# EAGLE design kludge (EAGLE 6.6.0)
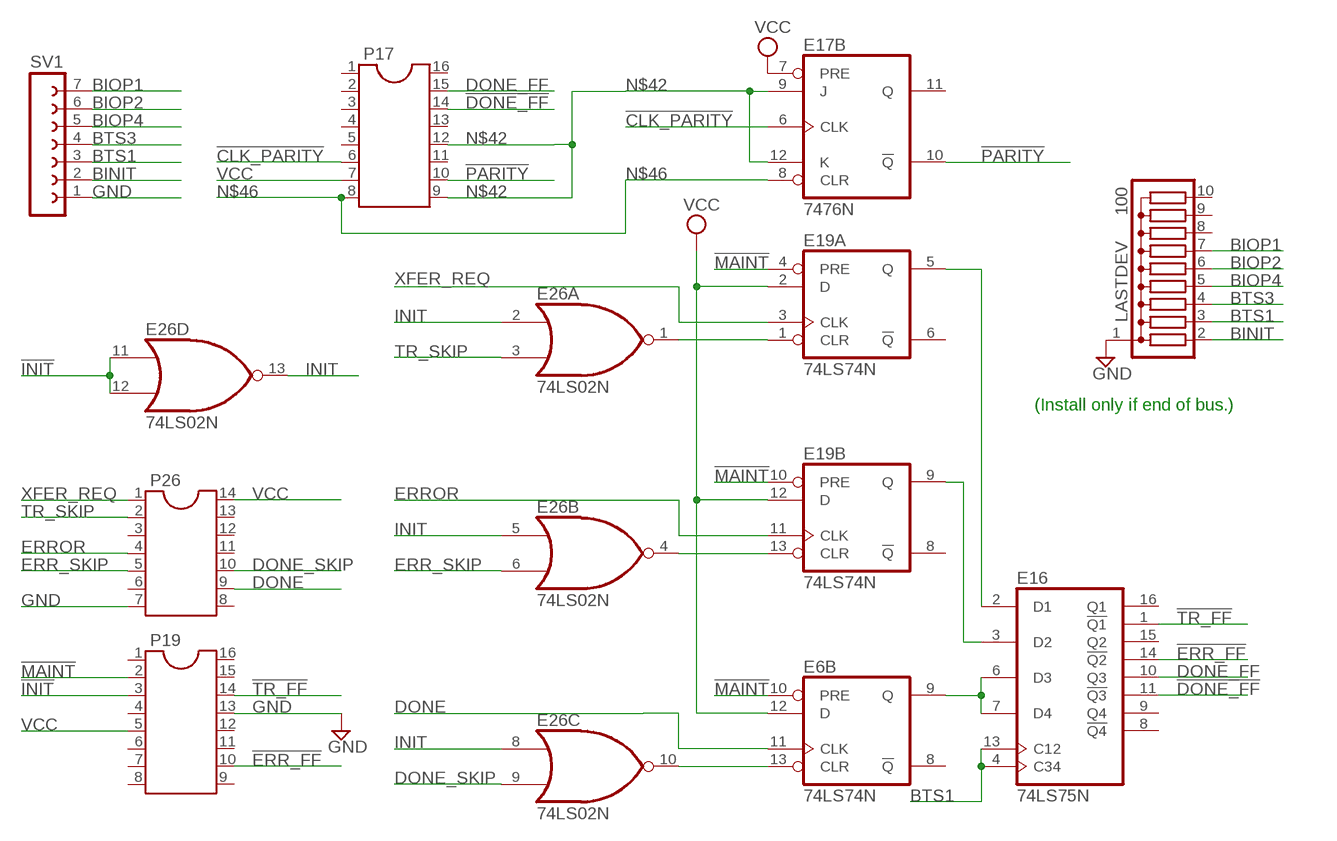
[diagram p0: schematic, sheet 1]

## Parts
E6  74LS74N  [DIL14]
E16  74LS75N  [DIL16]
E17  7476N  [DIL16]
E19  74LS74N  [DIL14]
E26  74LS02N  [DIL14]
LASTDEV  100  G09R  [SIL10]
P17  DIL16  [DIL16]
P19  DIL16  [DIL16]
P26  DIL14  [DIL14]
SV1  FE07-1  [FE07]

## Nets
!CLK_PARITY: E17.6(B:CLK) P17.6
!DONE_FF: E16.11(!Q3) P17.14
!ERR_FF: E16.14(!Q2) P19.10
!INIT: E26.11(D:I0) E26.12(D:I1) P19.3
!MAINT: E6.10(B:PRE) E19.4(A:PRE) E19.10(B:PRE) P19.2
!PARITY: E17.10(B:!Q) P17.10
!TR_FF: E16.1(!Q1) P19.14
BINIT: LASTDEV.2 SV1.2
BIOP1: LASTDEV.7 SV1.7
BIOP2: LASTDEV.6 SV1.6
BIOP4: LASTDEV.5 SV1.5
BTS1: E16.4(C34) E16.13(C12) LASTDEV.3 SV1.3
BTS3: LASTDEV.4 SV1.4
DONE: E6.11(B:CLK) P26.9
DONE_FF: E16.10(Q3) P17.15
DONE_SKIP: E26.9(C:I1) P26.10
ERR_SKIP: E26.6(B:I1) P26.5
ERROR: E19.11(B:CLK) P26.4
GND: LASTDEV.1 P19.13 P26.7 SV1.1
INIT: E26.2(A:I0) E26.5(B:I0) E26.8(C:I0) E26.13(D:O)
N$42: E17.9(B:J) E17.12(B:K) P17.9 P17.12
N$46: E17.8(B:CLR) P17.8
N$100: E16.2(D1) E19.5(A:Q)
N$103: E16.3(D2) E19.9(B:Q)
N$107: E6.9(B:Q) E16.6(D3) E16.7(D4)
N$108: E19.1(A:CLR) E26.1(A:O)
N$110: E19.13(B:CLR) E26.4(B:O)
N$111: E6.13(B:CLR) E26.10(C:O)
TR_SKIP: E26.3(A:I1) P26.2
VCC [supply]: E6.12(B:D) E17.7(B:PRE) E19.2(A:D) E19.12(B:D) P17.7 P19.5 P26.14
XFER_REQ: E19.3(A:CLK) P26.1
Unconnected: E6.1(A:CLR) E6.2(A:D) E6.3(A:CLK) E6.4(A:PRE) E6.5(A:Q) E6.6(A:!Q) E6.8(B:!Q) E16.8(!Q4) E16.9(Q4) E16.15(Q2) E16.16(Q1) E17.1(A:CLK) E17.2(A:PRE) E17.3(A:CLR) E17.4(A:J) E17.11(B:Q) E17.14(A:!Q) E17.15(A:Q) E17.16(A:K) E19.6(A:!Q) E19.8(B:!Q) LASTDEV.8 LASTDEV.9 LASTDEV.10 P17.1 P17.2 P17.3 P17.4 P17.5 P17.11 P17.13 P17.16 P19.1 P19.4 P19.6 P19.7 P19.8 P19.9 P19.11 P19.12 P19.15 P19.16 P26.3 P26.6 P26.8 P26.11 P26.12 P26.13

## Notes on the sheet
- (Install only if end of bus.)

## Power pins joined to a net without a drawn wire
GND: E6.7(P:GND) E16.12(GND) E17.13(P:GND) E19.7(P:GND) E26.7(P:GND)
VCC: E6.14(P:VCC) E16.5(VCC) E17.5(P:VCC) E19.14(P:VCC) E26.14(P:VCC)

## Library data of the parts
E6 E19 = 74xx-us:74*74: Dual D type positive edge triggered FLIP FLOP, preset and clear
E16 = 74xx-us:74*75: 4-bit bistable LATCH
E17 = 74xx-us:74*76: Dual J-K FLIP FLOP, preset and clear
E26 = 74xx-us:74*02: Quad 2-input NOR gate
LASTDEV = resistor-sil:G09R: SIL RESISTOR; OC_FARNELL: unknown; OC_NEWARK: unknown
P17 P19 = ic-package:DIL16: Dual In Line / Socket
P26 = ic-package:DIL14: Dual In Line / Socket
SV1 = con-lsta:FE07-1: FEMALE HEADER; OC_FARNELL: unknown; OC_NEWARK: unknown

## Net classes
1 supply: width 0.508 mm

## Board
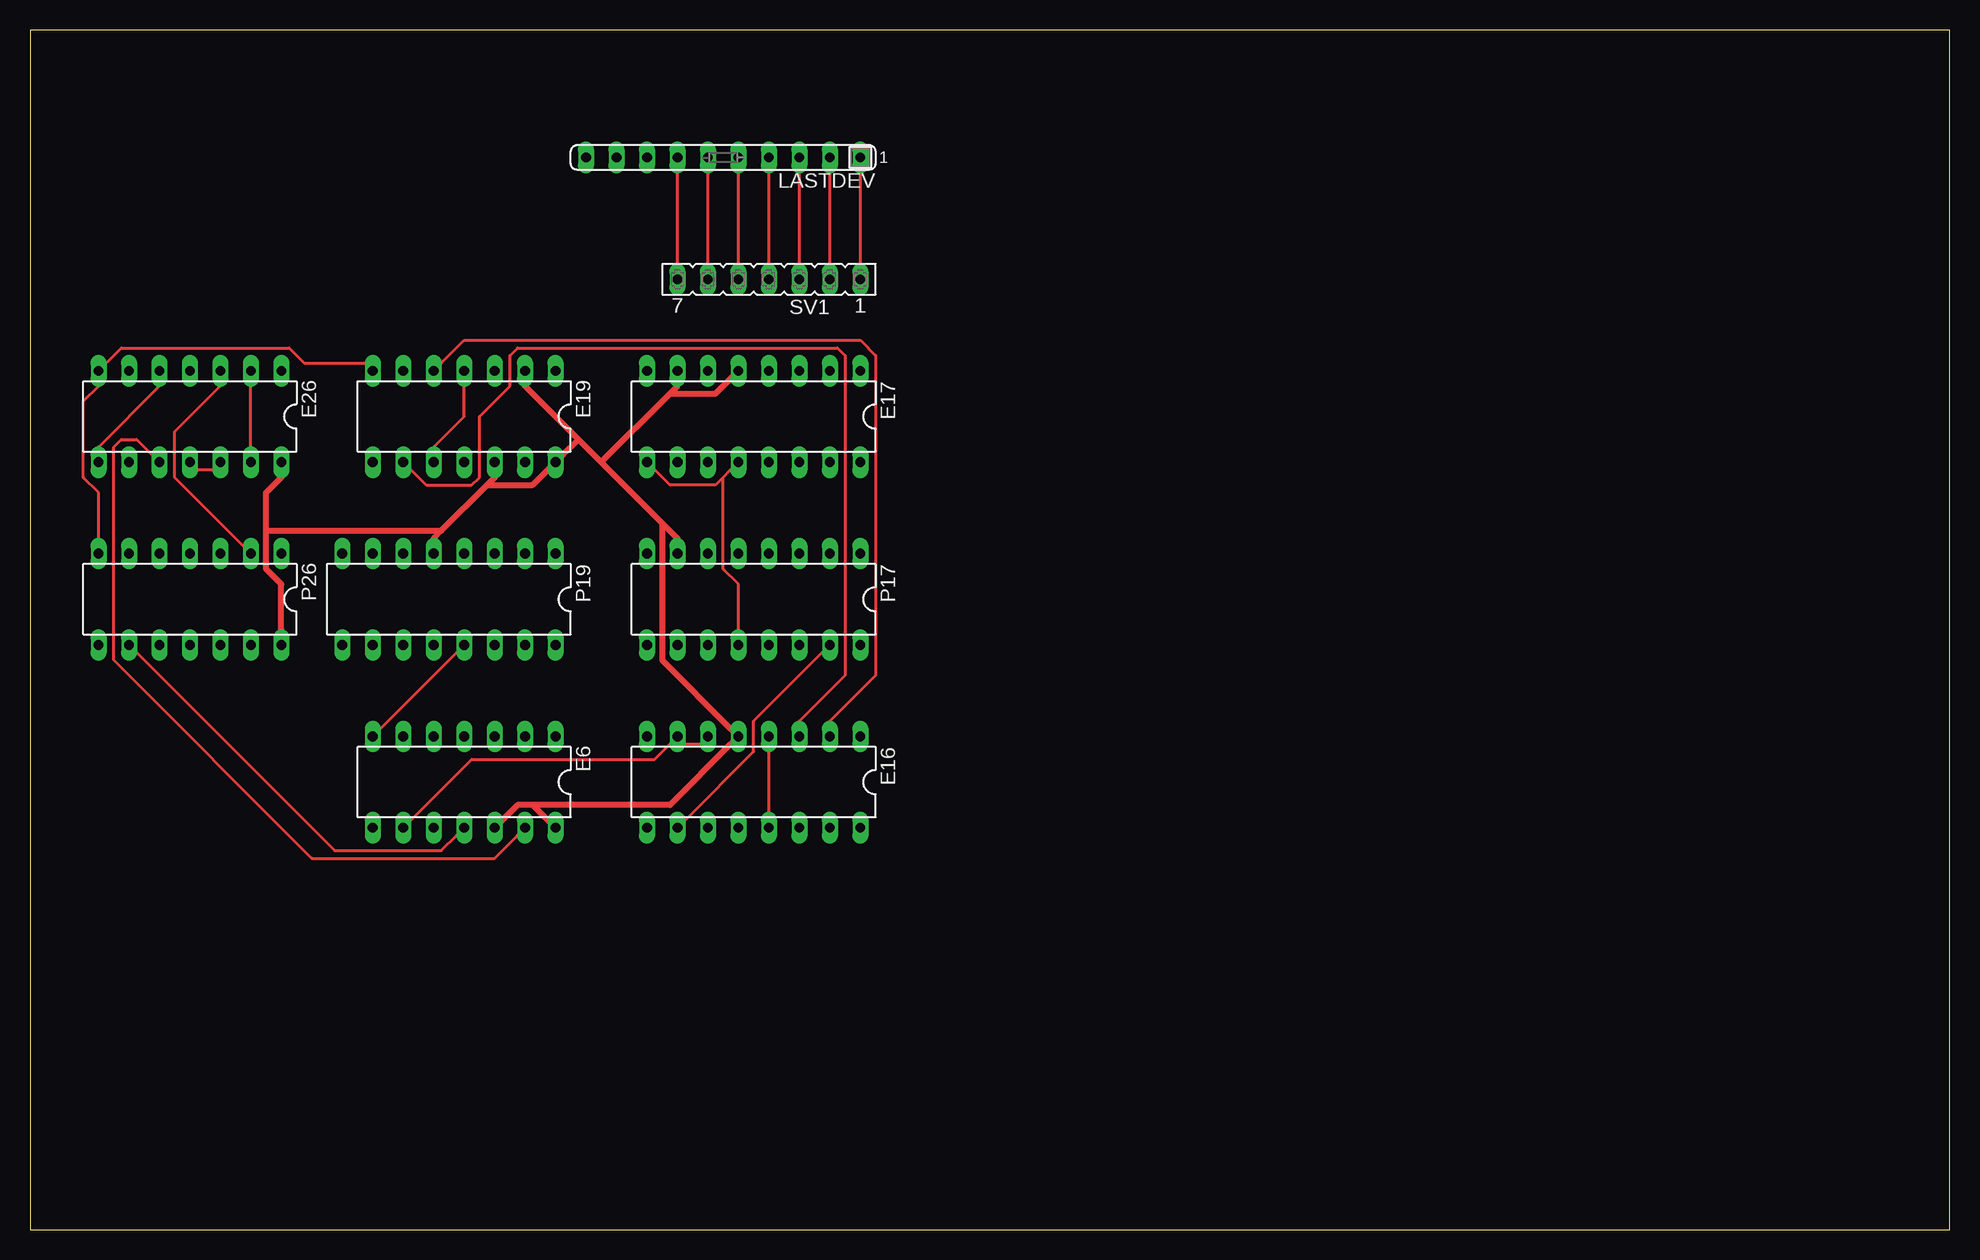
[diagram p1: board, top side]
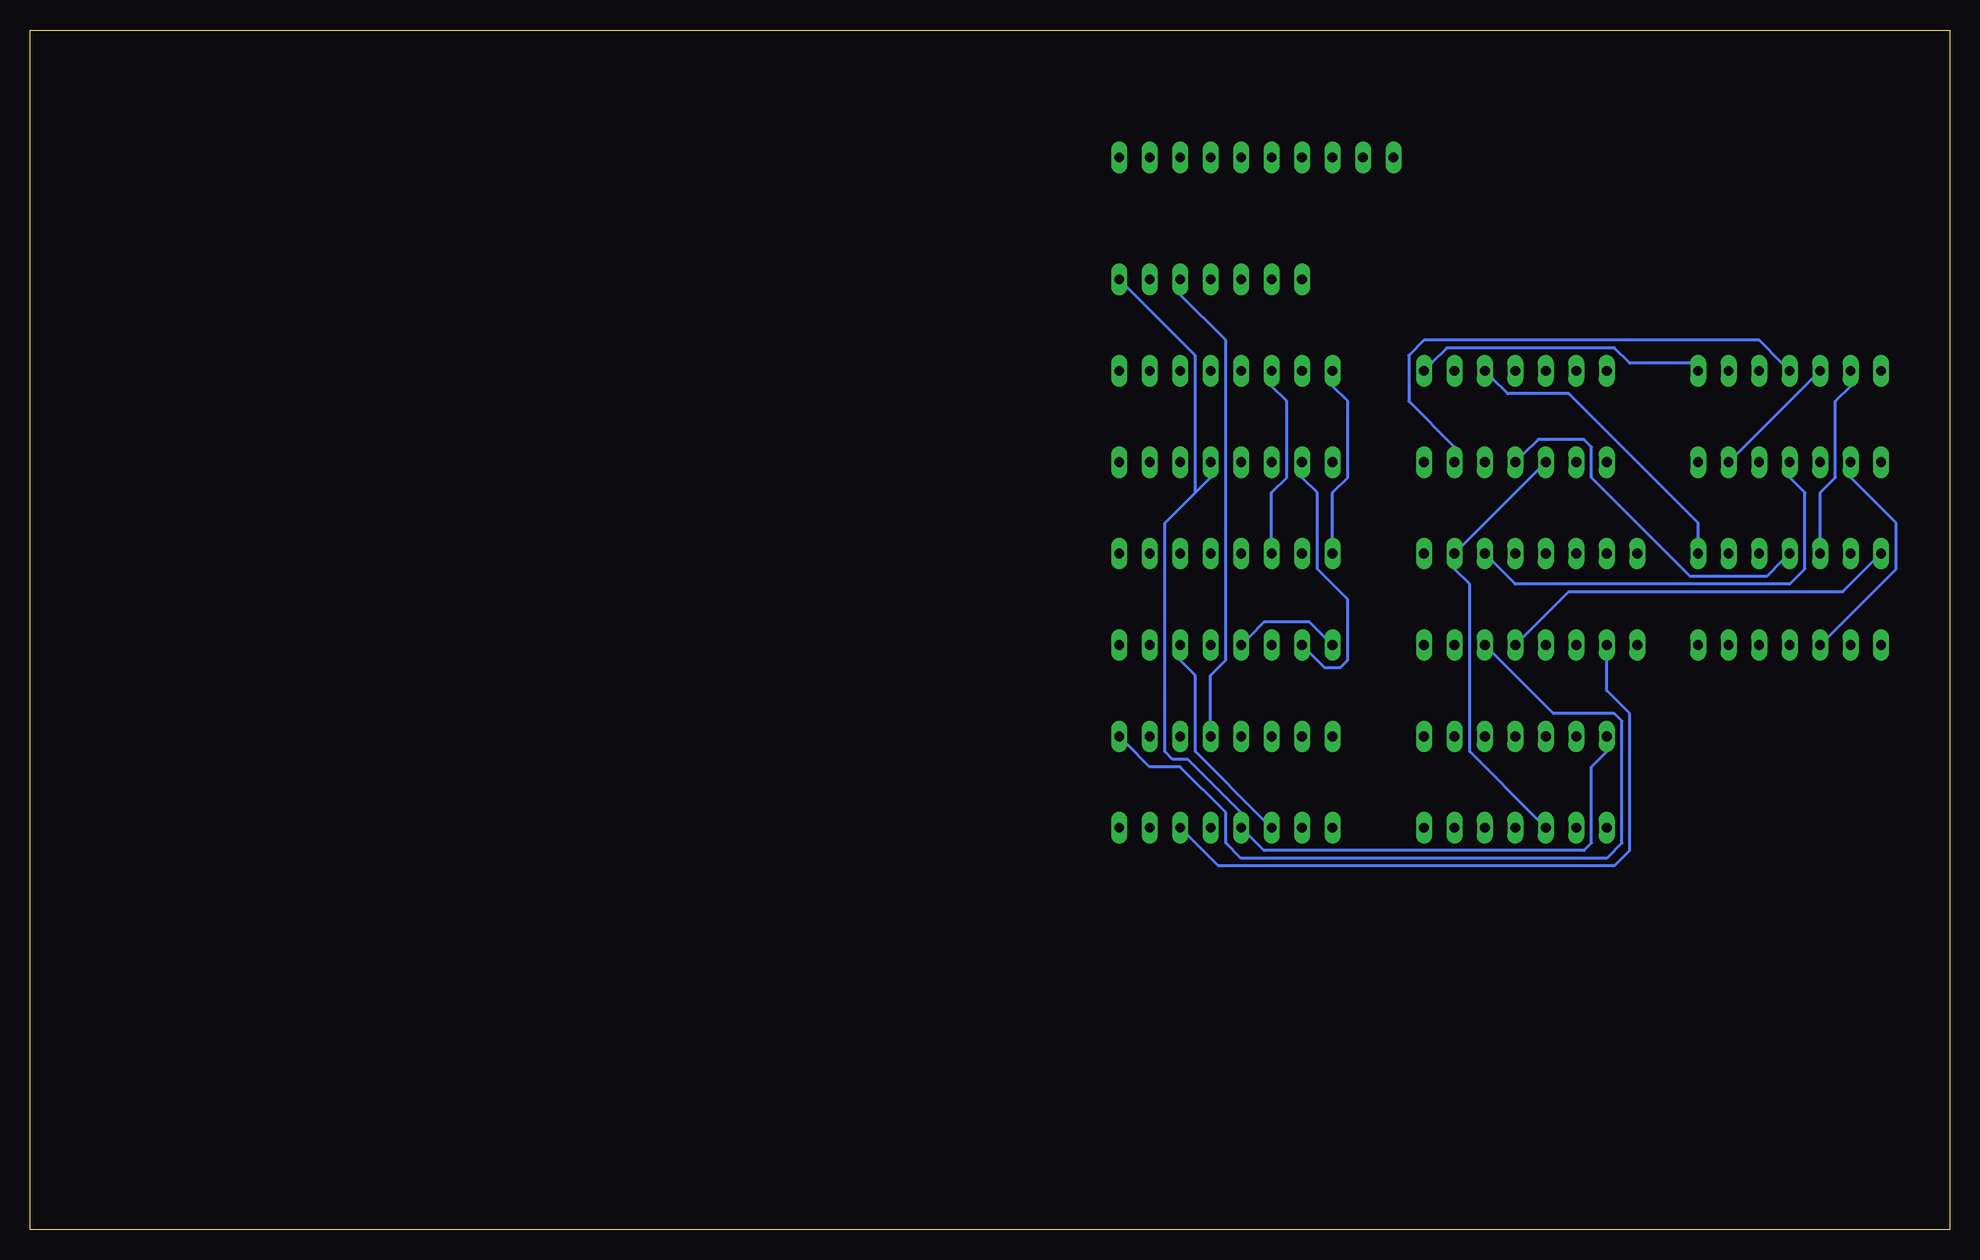
[diagram p2: board, bottom side, seen from below]

Size 160 x 100 mm. Coordinates in mm from the lower left corner, seen from the top.
Outline: 0,0 160,0 160,100 0,100 0,0
Copper layers (1*16): Top 0.035mm / dielectric 1.5mm / Bottom 0.035mm
Design rules "default": minimum track width 10mil, minimum drill 24mil, track to track 8mil, track to pad 8mil, pad to pad 8mil, via to via 8mil, smd to smd 8mil, copper to edge 40mil, drill to drill 8mil, minimum pad ring 10mil, minimum via ring 8mil, stop-mask expansion 4mil, vias tented up to drill 0mil, thermal gap 10mil

### Footprints (pad centres in the part's own frame; a part is rotated, then mirrored left to right if it is on the bottom)
DIL14 = drill 0.813 long: 1 -7.62,-3.81; 2 -5.08,-3.81; 3 -2.54,-3.81; 4 0,-3.81; 5 2.54,-3.81; 6 5.08,-3.81; 7 7.62,-3.81; 8 7.62,3.81; 9 5.08,3.81; 10 2.54,3.81; 11 0,3.81; 12 -2.54,3.81; 13 -5.08,3.81; 14 -7.62,3.81
DIL16 = drill 0.813 long: 1 -8.89,-3.81; 2 -6.35,-3.81; 3 -3.81,-3.81; 4 -1.27,-3.81; 5 1.27,-3.81; 6 3.81,-3.81; 7 6.35,-3.81; 8 8.89,-3.81; 9 8.89,3.81; 10 6.35,3.81; 11 3.81,3.81; 12 1.27,3.81; 13 -1.27,3.81; 14 -3.81,3.81; 15 -6.35,3.81; 16 -8.89,3.81
SIL10 = drill 0.813 long: 1 -11.43,0; 2 -8.89,0; 3 -6.35,0; 4 -3.81,0; 5 -1.27,0; 6 1.27,0; 7 3.81,0; 8 6.35,0; 9 8.89,0; 10 11.43,0
FE07 = drill 0.813 long: 1 -7.62,0; 2 -5.08,0; 3 -2.54,0; 4 0,0; 5 2.54,0; 6 5.08,0; 7 7.62,0

### Placement (x,y rotation side)
E6  36.19,37.3 180 top
E16  60.32,37.3 180 top
E17  60.32,67.78 180 top
E19  36.19,67.78 180 top
E26  13.33,67.78 180 top
LASTDEV  57.78,89.37 180 top
P17  60.32,52.54 180 top
P19  34.92,52.54 180 top
P26  13.33,52.54 180 top
SV1  61.59,79.21 180 top

### Tracks (layer width: path | path; a pad name or v marks a point on that pad's centre or on a via)
!CLK_PARITY
  Bottom 0.254: P17.6 56.51,57.62 56.51,61.43 55.24,62.7 55.24,69.05 56.51,70.32 E17.6
!DONE_FF
  Bottom 0.254: E16.11 57.15,34.12 62.86,39.84 62.86,46.19 64.13,47.46 P17.14
!ERR_FF
  Bottom 0.254: P19.10 28.57,47.46 28.57,44.92 26.66,43.02 26.66,31.58 27.93,30.31 60.96,30.31 63.5,32.85 E16.14
!INIT
  Top 0.254: E26.11 13.97,63.34 15.24,63.34 E26.12
  Bottom 0.254: P19.3 38.1,55.71 36.19,53.81 13.33,53.81 12.06,55.08 12.06,61.43 13.33,62.7 E26.11
!MAINT
  Top 0.254: E19.4 36.19,70.32 36.19,67.78 33.65,65.24 E19.10
  Bottom 0.254: E6.10 34.29,34.12 40,39.84 40,53.81 41.27,55.08 P19.2 40.64,56.98 34.29,63.34 E19.10
!PARITY
  Bottom 0.254: P17.10 53.34,48.09 52.07,46.82 50.8,46.82 50.16,47.46 50.16,52.54 52.7,55.08 52.7,61.43 53.97,62.7 E17.10
!TR_FF
  Bottom 0.254: P19.14 38.1,48.09 33.02,43.02 27.93,43.02 27.3,42.38 27.3,32.22 28.57,30.95 59.05,30.95 60.32,32.22 60.32,34.76 64.13,38.57 66.67,38.57 68.57,40.48 E16.1
BINIT
  Top 0.254: SV1.2 66.67,80.48 66.67,88.1 LASTDEV.2
BIOP1
  Top 0.254: SV1.7 53.97,80.48 53.97,88.1 LASTDEV.7
BIOP2
  Top 0.254: SV1.6 56.51,80.48 56.51,88.1 LASTDEV.6
BIOP4
  Top 0.254: SV1.5 59.05,80.48 59.05,88.1 LASTDEV.5
BTS1
  Top 0.254: E16.13 61.59,34.76 61.59,39.84 E16.4 | SV1.3 64.13,80.48 64.13,88.1 LASTDEV.3
  Bottom 0.254: E16.4 61.59,42.38 61.59,46.19 60.32,47.46 60.32,74.13 64.13,77.94 SV1.3
BTS3
  Top 0.254: SV1.4 61.59,80.48 61.59,88.1 LASTDEV.4
DONE
  Top 0.254: P26.9 8.89,48.09 25.39,31.58 34.29,31.58 35.55,32.85 E6.11
DONE_FF
  Top 0.254: E16.10 54.61,34.12 60.32,39.84 60.32,42.38 66.03,48.09 P17.15
DONE_SKIP
  Bottom 0.254: P26.10 10.16,49.37 4.44,55.08 4.44,58.89 8.25,62.7 E26.9
ERR_SKIP
  Bottom 0.254: P26.5 10.79,57.62 10.79,61.43 9.52,62.7 9.52,69.05 8.25,70.32 E26.6
ERROR
  Bottom 0.254: P26.4 13.97,55.71 15.24,54.45 21.58,54.45 29.84,62.7 29.84,65.24 30.47,65.88 34.29,65.88 35.55,64.61 E19.11
GND
  Top 0.254: E6.7 29.2,41.74 35.55,48.09 P19.13 | P26.7 5.71,57.62 5.71,61.43 4.44,62.7 4.44,69.05 5.71,70.32 E26.7 6.34,72.22 7.62,73.5 21.58,73.5 22.86,72.22 27.93,72.22 E19.7 | SV1.1 69.21,80.48 69.21,88.1 LASTDEV.1
  Bottom 0.254: 62.86,61.43 65.4,58.89 65.4,39.84 64.77,39.2 63.5,39.2 59.05,34.76 E16.12 58.41,32.85 57.15,31.58 30.47,31.58 29.84,32.22 29.84,38.57 28.57,39.84 E6.7 | 62.86,61.43 61.59,62.7 E17.13 | P19.13 35.55,49.37 31.74,53.17 8.89,53.17 6.34,55.71 P26.7 | 62.86,61.43 62.86,72.86 68.57,78.58 SV1.1
INIT
  Top 0.254: E26.13 18.41,65.24 18.41,70.32 E26.2 | E26.8 5.71,65.24 10.79,70.32 E26.5
  Bottom 0.254: E26.13 17.77,64.61 11.43,70.95 E26.5
N$42
  Top 0.254: 57.78,62.7 58.41,63.34 E17.12 | 57.78,62.7 57.15,62.06 53.34,62.06 52.07,63.34 E17.9 | 57.78,62.7 57.78,55.08 59.05,53.81 59.05,50 P17.12
  Bottom 0.254: P17.9 52.07,49.37 53.34,50.63 57.15,50.63 58.41,49.37 P17.12
N$46
  Bottom 0.254: P17.8 51.43,57.62 51.43,61.43 50.16,62.7 50.16,69.05 51.43,70.32 E17.8
N$100
  Top 0.254: E19.5 34.29,72.22 36.19,74.13 69.21,74.13 70.48,72.86 70.48,46.19 66.67,42.38 E16.2
N$103
  Top 0.254: E19.9 31.74,63.34 33.02,62.06 36.83,62.06 37.46,62.7 37.46,67.78 40,70.32 40,72.86 40.64,73.5 67.3,73.5 67.94,72.86 67.94,46.19 64.13,42.38 E16.3
N$107
  Top 0.254: E6.9 31.74,34.12 36.83,39.2 52.07,39.2 53.34,40.48 E16.7 54.61,40.48 55.88,40.48 E16.6
N$108
  Bottom 0.254: E26.1 21.58,72.22 26.66,72.22 27.93,73.5 41.91,73.5 43.18,72.22 E19.1
N$110
  Bottom 0.254: E26.4 13.97,72.22 15.87,74.13 43.81,74.13 45.08,72.86 45.08,69.05 41.27,65.24 E19.13
N$111
  Top 0.254: E26.10 10.16,64.61 8.89,65.88 7.62,65.88 6.98,65.24 6.98,47.46 23.49,30.95 38.73,30.95 40.64,32.85 E6.13
TR_SKIP
  Top 0.254: P26.2 17.77,56.98 12.06,62.7 12.06,66.51 15.87,70.32 E26.3
VCC
  Top 0.508: 19.68,58.25 19.68,61.43 20.95,62.7 E26.14 | 19.68,58.25 19.68,55.08 20.95,53.81 20.95,50 P26.14 | 38.1,62.06 38.73,62.7 E19.12 | 34.29,58.25 38.1,62.06 | 34.29,58.25 33.65,57.62 P19.5 | 38.1,62.06 41.91,62.06 43.18,63.34 E19.14 44.45,64.61 45.72,65.88 | 19.68,58.25 34.29,58.25 | 41.91,35.39 40.64,35.39 39.37,34.12 E6.12 | 41.91,35.39 43.18,34.12 E6.14 | 41.91,35.39 53.34,35.39 58.41,40.48 E16.5 58.41,41.74 52.7,47.46 52.7,58.89 | 45.72,65.88 41.27,70.32 E19.2 | 45.72,65.88 47.62,63.97 | 47.62,63.97 52.7,58.89 | 52.7,58.89 53.97,57.62 P17.7 | 47.62,63.97 53.34,69.69 | 53.34,69.69 53.97,70.32 E17.7 | 53.34,69.69 57.15,69.69 58.41,70.95 E17.5
XFER_REQ
  Bottom 0.254: P26.1 20.95,57.62 20.95,58.89 31.74,69.69 36.83,69.69 38.1,70.95 E19.3